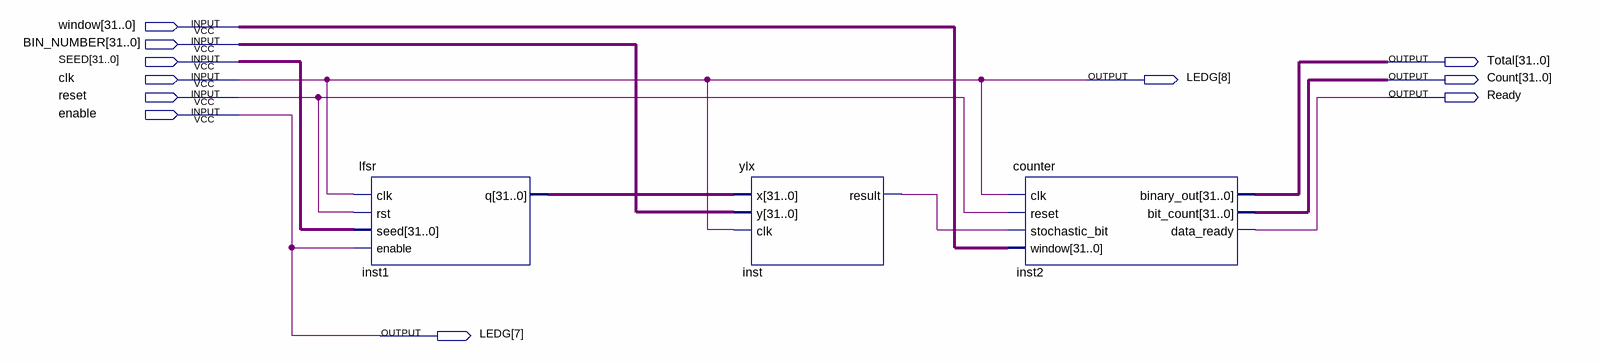
[diagram p0: schematic sheet]
// Quartus schematic B2S_S2B.bdf as structural Verilog: 3 symbols, 11 pins
module B2S_S2B (
  input  [31:0] window,
  input  [31:0] BIN_NUMBER,
  input  [31:0] SEED,
  input  clk,
  input  reset,
  input  enable,
  output [31:0] Total,
  output [8:7] LEDG,
  output [31:0] Count,
  output Ready
);

  wire inst_result;
  wire [31:0] inst1_q;

  lfsr inst1 (.clk(clk), .rst(reset), .seed(SEED), .enable(enable), .q(inst1_q));
  ylx inst (.x(inst1_q), .y(BIN_NUMBER), .clk(clk), .result(inst_result));
  counter inst2 (
    .clk(clk), .reset(reset), .stochastic_bit(inst_result), .window(window), .binary_out(Total),
    .bit_count(Count), .data_ready(Ready));

  assign LEDG = {clk, enable};
endmodule
